# Altium project WirelessLamp.PrjPcb
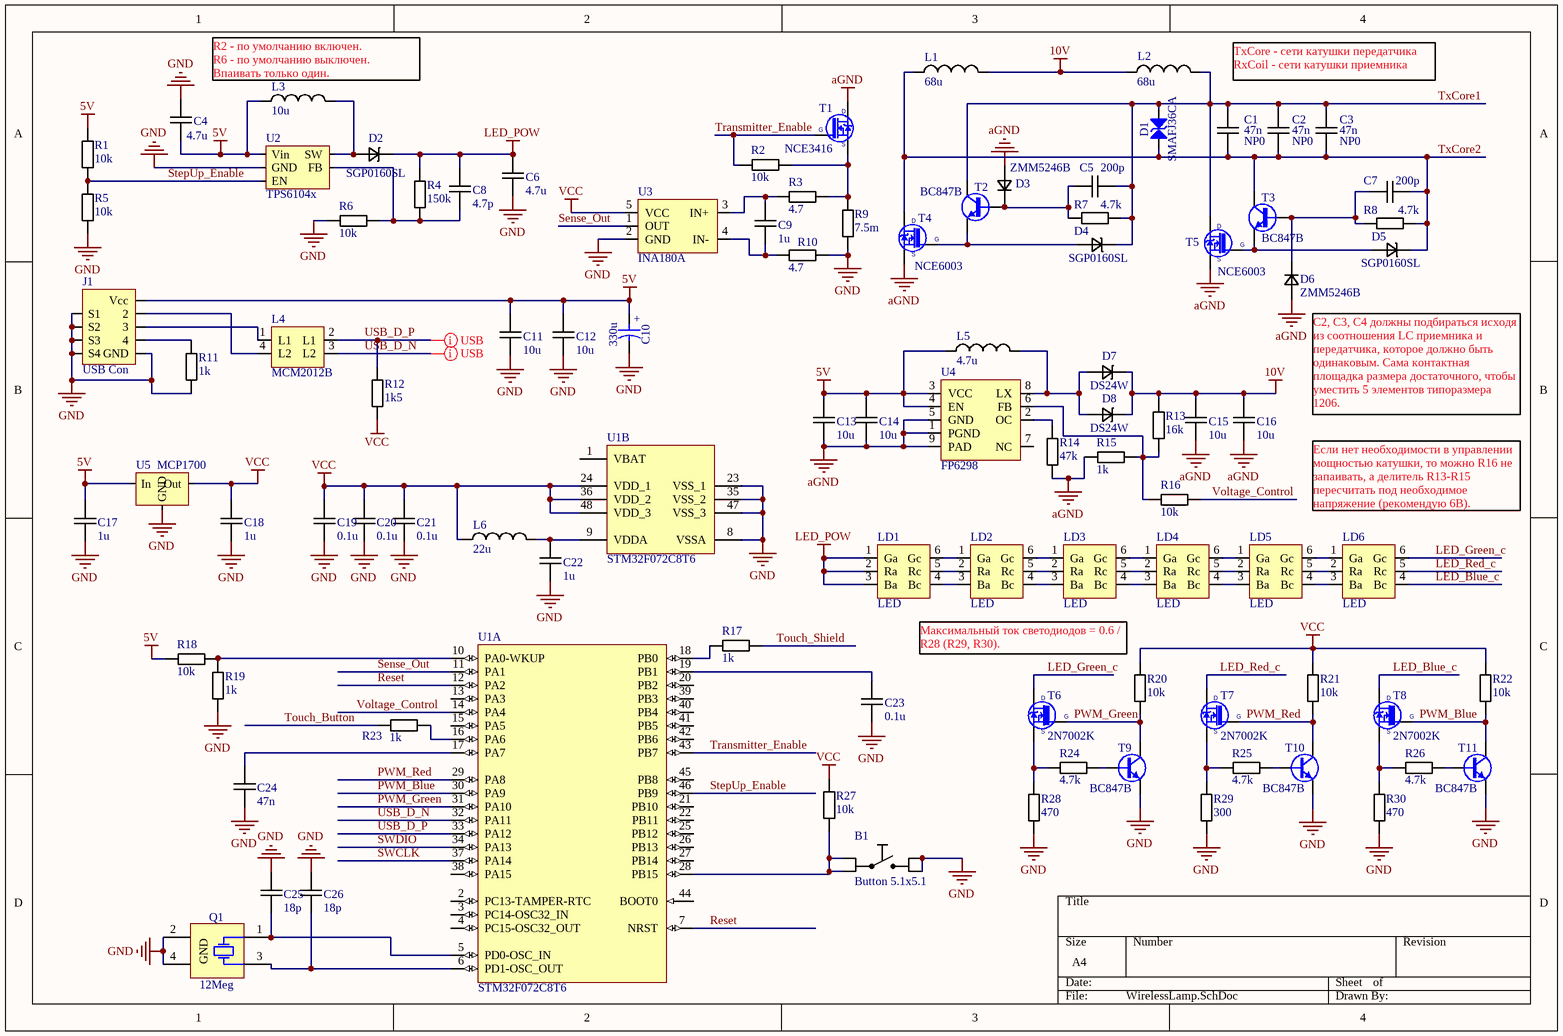
[diagram p0: WirelessLamp.SchDoc]
2 sheets, 124 parts. Net scope: global (net labels, ports and power ports of the same name join across sheets).
Board file: WirelessLamp.PcbDoc
Sheets:
  WirelessLamp.SchDoc
  WirelessLampReceiver.SchDoc

## Sheet WirelessLamp.SchDoc
size A4

### Parts
B1  Button 5.1x5.1  [TS-1187 combo]
C1  47n  Name: NP0  [CAPC3225L]
C2  47n  Name: NP0  [CAPC3225L]
C3  47n  Name: NP0  [CAPC3225L]
C4  4.7u  [CAPC3216L]
C5  200p  [CAPC2012L]
C6  4.7u  [CAPC3216L]
C7  200p  [CAPC2012L]
C8  4.7p  [CAPC1608L]
C9  1u  [CAPC1608L]
C10  330u  [CAPPR250-680X1080]
C11  10u  [CAPC3216L]
C12  10u  [CAPC3216L]
C13  10u  [CAPC3216L]
C14  10u  [CAPC3216L]
C15  10u  [CAPC3225L]
C16  10u  [CAPC3225L]
C17  1u  [CAPC2012L]
C18  1u  [CAPC2012L]
C19  0.1u  [CAPC1608L]
C20  0.1u  [CAPC1608L]
C21  0.1u  [CAPC1608L]
C22  1u  [CAPC1608L]
C23  0.1u  [CAPC2012L]
C24  47n  [CAPC3216L]
C25  18p  [CAPC1608L]
C26  18p  [CAPC1608L]
D1  SMAFJ36CA  [DIOM5226X262N]
D2  SGP0160SL  [SOD-323F]
D3  ZMM5246B  [MELF-D3512-1405]
D4  SGP0160SL  [SOD-323F]
D5  SGP0160SL  [SOD-323F]
D6  ZMM5246B  [MELF-D3512-1405]
D7  DS24W  [SOD123]
D8  DS24W  [SOD123]
J1  USB Con  [ZX62D-B-5PA8]
L1  68u  [Ind 8x8]
L2  68u  [Ind 8x8]
L3  10u  [INDC3225L]
L4  MCM2012B  [MCM2012B]
L5  4.7u  [Ind 8x8]
L6  22u  [INDC2012L]
LD1  LED  [LED5060]
LD2  LED  [LED5060]
LD3  LED  [LED5060]
LD4  LED  [LED5060]
LD5  LED  [LED5060]
LD6  LED  [LED5060]
Q1  12Meg  [XTAL_ABRACON_ABM8-166]
R1  10k  [RESC1608L]
R2  10k  [RESC1608L]
R3  4.7  [RESC1608L]
R4  150k  [RESC1608L]
R5  10k  [RESC1608L]
R6  10k  [RESC1608L]
R7  4.7k  [RESC2012L]
R8  4.7k  [RESC2012L]
R9  7.5m  [RESC2012M]
R10  4.7  [RESC1608L]
R11  1k  [RESC1608L]
R12  1k5  [RESC1608L]
R13  16k  [RESC1608L]
R14  47k  [RESC1608L]
R15  1k  [RESC1608L]
R16  10k  [RESC1608L]
R17  1k  [RESC1608L]
R18  10k  [RESC1608L]
R19  1k  [RESC1608L]
R20  10k  [RESC1608L]
R21  10k  [RESC1608L]
R22  10k  [RESC1608L]
R23  1k  [RESC1608L]
R24  4.7k  [RESC1608L]
R25  4.7k  [RESC1608L]
R26  4.7k  [RESC1608L]
R27  10k  [RESC1608L]
R28  470  [RESC2012L]
R29  300  [RESC2012L]
R30  470  [RESC2012L]
T1  NCE3416  [SOT95P237X112-3N]
T2  BC847B  [SOT95P230X110-3N]
T3  BC847B  [SOT95P230X110-3N]
T4  NCE6003  [SOT95P237X112-3N]
T5  NCE6003  [SOT95P237X112-3N]
T6  2N7002K  [SOT95P237X112-3N]
T7  2N7002K  [SOT95P237X112-3N]
T8  2N7002K  [SOT95P237X112-3N]
T9  BC847B  [SOT95P230X110-3N]
T10  BC847B  [SOT95P230X110-3N]
T11  BC847B  [SOT95P230X110-3N]
U1  STM32F072C8T6  [STM-LQFP48_N]  (parts A,B of 2)
U2  TPS6104x  [SOT23-5AL]
U3  INA180A  [SOT23-5AN]
U4  FP6298  [SOIC127P600-8DL]
U5  MCP1700  [SOT23-3L]

### Nets
5V: C4.1 C10.1 C11.2 C12.2 C13.2 C14.2 C17.2 J1.1(Vcc) L3.1 L5.1 R1.2 R18.2 U2.5(Vin) U4.3(VCC) U4.4(EN) U5.3(In)
10V: C15.2 C16.2 D7.2 D8.2 L1.2 L2.1 R13.2
aGND: C13.1 C14.1 C15.1 C16.1 D3.1 D6.1 R14.1 R15.1 T1.3(D) T4.2(S) T5.2(S) U4.1(PGND) U4.5(GND) U4.9(PAD)
GND: B1.3(FB) B1.4(FB) C4.2 C6.1 C10.2 C11.1 C12.1 C17.1 C18.1 C19.1 C20.1 C21.1 C22.1 C23.1 C24.1 C25.2 C26.2 J1.5(GND) J1.S1 J1.S2 J1.S3 J1.S4 Q1.2(GND) Q1.4(GND) R5.1 R6.1 R9.1 R10.2 R11.2 R19.1 R28.2 R29.1 R30.1 T9.2(E) T10.2(E) T11.2(E) U1.8(VSSA) U1.23(VSS_1) U1.35(VSS_2) U1.47(VSS_3) U2.2(GND) U3.2(GND) U5.1(GND)
LED_POW: C6.2 C8.2 D2.2 LD1.1(Ga) LD1.2(Ra) LD1.3(Ba) R4.2
VCC: C18.2 C19.2 C20.2 C21.2 L6.1 R12.1 R20.2 R21.2 R22.2 R27.2 U1.24(VDD_1) U1.36(VDD_2) U1.48(VDD_3) U3.5(VCC) U5.2(Out)
LED_Blue_c: LD6.4(Bc) T8.3(D)
LED_Green_c: LD6.6(Gc) T6.3(D)
LED_Red_c: LD6.5(Rc) T7.3(D)
PWM_Blue: R22.1 T8.1(G) T11.3(C) U1.30(PA9)
PWM_Green: R20.1 T6.1(G) T9.3(C) U1.31(PA10)
PWM_Red: R21.1 T7.1(G) T10.3(C) U1.29(PA8)
Reset: U1.7(NRST) U1.12(PA2)
Sense_Out: U1.11(PA1) U3.1(OUT)
StepUp_Enable: R1.1 R5.2 U1.46(PB9) U2.4(EN)
SWCLK: U1.37(PA14)
SWDIO: U1.34(PA13)
Touch_Button: R23.1
Touch_Shield: R17.2
Transmitter_Enable: R2.1 T1.1(G) U1.43(PB7)
TxCore1: C1.2 C2.2 C3.2 C5.1 D1.1(C) D4.2 L2.2 R7.1 T2.3(C) T5.3(D)
TxCore2: C1.1 C2.1 C3.1 C7.1 D1.2(A) D5.2 L1.1 R8.1 T3.3(C) T4.3(D)
USB_D_N: L4.3(L2) U1.32(PA11)
USB_D_P: L4.2(L1) R12.2 U1.33(PA12)
Voltage_Control: R16.2 U1.14(PA4)
NetB1_1: B1.1(FB) B1.2(FB) R27.1 U1.28(PB15)
NetC5_2: C5.2 D3.2 R7.2 T2.1(B)
NetC7_2: C7.2 D6.2 R8.2 T3.1(B)
NetC8_1: C8.1 R4.1 R6.2 U2.3(FB)
NetC9_1: C9.1 R10.1 U3.4(IN-)
NetC9_2: C9.2 R3.1 U3.3(IN+)
NetC22_2: C22.2 L6.2 U1.9(VDDA)
NetC23_2: C23.2 U1.19(PB1)
NetC24_2: C24.2 U1.17(PA7)
NetC25_1: C25.1 Q1.1(X) U1.5(PD0-OSC_IN)
NetC26_1: C26.1 Q1.3(X) U1.6(PD1-OSC_OUT)
NetD2_1: D2.1 L3.2 U2.1(SW)
NetD4_1: D4.1 T2.2(E) T4.1(G)
NetD5_1: D5.1 T3.2(E) T5.1(G)
NetD7_1: D7.1 D8.1 L5.2 U4.8(LX)
NetJ1_2: J1.2 L4.4(L2)
NetJ1_3: J1.3 L4.1(L1)
NetJ1_4: J1.4 R11.1
NetLD1_4: LD1.4(Bc) LD2.3(Ba)
NetLD1_5: LD1.5(Rc) LD2.2(Ra)
NetLD1_6: LD1.6(Gc) LD2.1(Ga)
NetLD2_4: LD2.4(Bc) LD3.3(Ba)
NetLD2_5: LD2.5(Rc) LD3.2(Ra)
NetLD2_6: LD2.6(Gc) LD3.1(Ga)
NetLD3_4: LD3.4(Bc) LD4.3(Ba)
NetLD3_5: LD3.5(Rc) LD4.2(Ra)
NetLD3_6: LD3.6(Gc) LD4.1(Ga)
NetLD4_4: LD4.4(Bc) LD5.3(Ba)
NetLD4_5: LD4.5(Rc) LD5.2(Ra)
NetLD4_6: LD4.6(Gc) LD5.1(Ga)
NetLD5_4: LD5.4(Bc) LD6.3(Ba)
NetLD5_5: LD5.5(Rc) LD6.2(Ra)
NetLD5_6: LD5.6(Gc) LD6.1(Ga)
NetR2_2: R2.2 R3.2 R9.2 T1.2(S)
NetR13_1: R13.1 R15.2 R16.1 U4.6(FB)
NetR14_2: R14.2 U4.2(OC)
NetR17_1: R17.1 U1.18(PB0)
NetR18_1: R18.1 R19.2 U1.10(PA0-WKUP)
NetR23_2: R23.2 U1.16(PA6)
NetR24_1: R24.1 R28.1 T6.2(S)
NetR24_2: R24.2 T9.1(B)
NetR25_1: R25.1 R29.2 T7.2(S)
NetR25_2: R25.2 T10.1(B)
NetR26_1: R26.1 R30.2 T8.2(S)
NetR26_2: R26.2 T11.1(B)

Not connected (* = marked no-connect by the designer): U1 1(VBAT) 2(PC13-TAMPER-RTC) 3(PC14-OSC32_IN) 4(PC15-OSC32_OUT) 13(PA3) 15(PA5) 20(PB2) 21(PB10) 22(PB11) 25(PB12) 26(PB13) 27(PB14) 38(PA15) 39(PB3) 40(PB4) 41(PB5) 42(PB6) 44(BOOT0) 45(PB8); U4 7(NC)

### Layout directives
differential pair: USB_D_N, USB_D_P

### Notes on the sheet
- (near L3) R2 - по умолчанию включен.
  R6 - по умолчанию выключен.
  Впаивать только один.
- TxCore - сети катушки передатчика
  RxCoil - сети катушки приемника
- (near D6) C2, C3, C4 должны подбираться исходя из соотношения LC приемника и передатчика, которое должно быть одинаковым. Сама контактная площадка размера достаточного, чтобы уместить 5 элементов типоразмера 1206.
- Если нет необходимости в управлении мощностью катушки, то можно R16 не запаивать, а делитель R13-R15 пересчитать под необходимое напряжение (рекомендую 6В).
- Максимальный ток светодиодов = 0.6 / R28 (R29, R30).
- (in symbol CAER_100UF_16V_20%_CHEMI-CON_APSA160ELL101MFA5G) +

### Library data of the parts
B1 = Button 5.1x5.1: Part: TS-1187A-B-A-B; Link: https://lcsc.com/product-detail/Tactile-Switches_XKB-Enterprise-TS-1187-B-A-A_C318884.html; LCSC Part: C318884
C1-C3 = Capacitor: Part: GRM31M5C1H473JA01L; Voltage: 50V; Case: 1206; Value: 47n; LCSC Part: C21812; Link: https://lcsc.com/product-detail/Multilayer-Ceramic-Capacitors-MLCC-SMD-SMT_muRata_GRM31M5C1H473JA01L_47nF-473-10-50V_C21812.html
C4 C8 C9 C11 C12 C17-C26 = Capacitor: Name: *
  C4: Case: 1206; Value: 4.7u
  C8: Case: 0603; Value: 4.7p
  C9 C22: Case: 0603; Value: 1u
  C11 C12: Case: 1206; Value: 10u
  C17 C18: Case: *; Value: 1u
  C19-C21: Case: 0603; Value: 0.1u
  C23: Case: 0805; Value: 0.1u
  C24: Case: 1206; Value: 47n
  C25 C26: Case: 0603; Value: 18p
C5-C7 C15 C16 = Capacitor: Voltage: 50V; Name: *
  C5 C7: Case: 0805; Value: 200p
  C6: Case: 1206; Value: 4.7u
  C15 C16: Case: 1210; Value: 10u
C10 = CAER_100UF_16V_20%_CHEMI-CON_APSA160ELL101MFA5G: Polarised capacitor; Part: 6R3AREP331M06X5E20; Voltage: 6.3V; Value: 330u; Case: LS2.5 D6.3 x H10.5; Author: CERN DEM JLC; Link: https://lcsc.com/product-detail/Solid-Polymer-Electrolytic-Capacitor_330uF-6-3V_C176297.html; LCSC Part: C176297
C13 C14 = Capacitor: Voltage: 16V; Name: *; Case: 1206; Value: 10u
D1 = SMAJ24CA: Transient Voltage Suppressor Diode (Bi-Directional); Case: DO-214AC; Author: CERN DEM JLC; Name: SMAFJ36CA; Link: https://lcsc.com/product-detail/TVS_SMAFJ36CA_C169459.html; Part: SMAFJ36CA; LCSC Part: C169459
D2 D4 D5 D7 D8 = Schotky: Value: *
  D2: Name: SGP0160SL; Case: SOD-323F; Part: SGP0160SL; Link: https://lcsc.com/product-detail/Schottky-Barrier-Diodes-SBD_SGP0160SL_C110413.html; LCSC Part: C110413
  D4: Name: SGP0160SL; Case: SOD-323F; Part: SGP0160SL; LCSC Part: C110413; Limk: https://lcsc.com/product-detail/Schottky-Barrier-Diodes-SBD_SGP0160SL_C110413.html
  D5: Name: SGP0160SL; Case: SOD-323F; Part: SGP0160SL; LCSC Part: C110413; Link: https://lcsc.com/product-detail/Schottky-Barrier-Diodes-SBD_SGP0160SL_C110413.html
  D7: Name: DS24W; Case: SOD-123F; Part: DS24W; LCSC Part: C108810; Link: https://lcsc.com/product-detail/Schottky-Barrier-Diodes-SBD_DS24W_C108810.html
  D8: Name: DS24W; Case: SOD-123F; Link: https://lcsc.com/product-detail/Schottky-Barrier-Diodes-SBD_DS24W_C108810.html; Part: DS24W; LCSC Part: C108810
D3 D6 = Diode_MELF: Name: ZMM5246B; Case: LL-34; Value: *; Part: ZMM5246B; LCSC Part: C118699; Link: https://lcsc.com/product-detail/Zener-Diodes_ZMM5246B_C118699.html
J1 = USB: Case: *; Name: *; Datasheet: https://media.digikey.com/pdf/Data%20Sheets/Hirose%20PDFs/ZX62D-AB-5P8%20RoHS.pdf
L1 L2 = Inductor: Name: SMNR8040-680MT; Case: 8040; Value: 68u; Part: SMNR8040-680MT; LCSC Part: C266439; Link: https://lcsc.com/product-detail/Inductors-SMD_ShunXiang-Connaught-Elec-SMNR8040-680MT_C266439.html
L3 = Inductor: Part: MRSC252A10-100M-N; Name: Chilisin Elec MRSC252A10-100M-N; Case: SMD,2.5x2.0x1.0mm; Value: 10u; LCSC Part: C329581; Link: https://lcsc.com/product-detail/Inductors-SMD_Chilisin-Elec-MRSC252A10-100M-N_C329581.html
L4 = MCM2012B: Part: MCM2012B900GBE; Name: MCM2012B; Link: https://lcsc.com/product-detail/EMI-RFI-Filters-LC-RC-Networks_INPAQ-MCM2012B900GBE_C315725.html; LCSC Part: C315725
L5 = Inductor: Name: SMNR8040-4R7MT; Case: 8040; Value: 4.7u; Part: SMNR8040-4R7MT; Link: https://lcsc.com/product-detail/Inductors-SMD_ShunXiang-Connaught-Elec-SMNR8040-4R7MT_C266436.html; LCSC Part: C266436
L6 = Inductor: Name: *; Case: 0805; Value: 22u
LD1-LD6 = RGB LED 5060: Part: HL-AF-5060H271BU46FU79GC-S1-THL; Name: LED; Link: https://lcsc.com/product-detail/Light-Emitting-Diodes-LED_Hongli-Zhihui-HONGLITRONIC-HL-AF-5060H271BU46FU79GC-S1-THL_C219409.html; LCSC Part: C219409
Q1 = XTAL_114.285MHZ_ABRACON_ABM8-166-114.285MHZ: Crystal 4 pins 1=XTAL Control 2=GND3=XTAL 4=GND; Part: 7U12000E12UCG; Value: 12Meg; Author: CERN DEM MR; Link: https://lcsc.com/product-detail/SMD-Crystals_SHENZHEN-CRYSTAL-TECH-7U12000E12UCG_C251605.html; LCSC Part: C251605
R1-R30 = Resistor: Model: *
  R1 R2 R5 R6 R16 R18 R20-R22 R27: Case: 0603; Value: 10k
  R3 R10: Case: 0603; Value: 4.7
  R4: Case: 0603; Value: 150k
  R7 R8: Case: 0805; Value: 4.7k
  R9: Case: 0805; Value: 7.5m; LCSC Part: C156368
  R11: Case: *; Value: 1k
  R12: Case: *; Value: 1k5
  R13: Case: 0603; Value: 16k
  R14: Case: 0603; Value: 47k
  R15 R17 R19 R23: Case: 0603; Value: 1k
  R24-R26: Case: 0603; Value: 4.7k
  R28 R30: Case: 0805; Value: 470
  R29: Case: 0805; Value: 300
T1 T4-T8 = IRLML2803PBF: N-CHANNEL MOSFET WITH ZENER DIODE; Case: SOT23-3; Author: CERN DEM JMW
  T1: Name: NCE3416; Link: https://lcsc.com/product-detail/MOSFET_Wuxi-NCE-Power-Semiconductor-NCE3416_C113491.html; Part: NCE3416; LCSC Part: C113491
  T4 T5: Name: NCE6003; Part: NCE6003; Link: https://lcsc.com/product-detail/MOSFET_Wuxi-NCE-Power-Semiconductor-NCE6003_C112351.html; LCSC Part: C112351
  T6: Name: 2N7002K; Part: 2N7002K; LCSC Part: C38161; Link: https://lcsc.com/product-detail/MOSFET_Changjiang-Electronics-Tech-CJ-2N7002K_C38161.html
  T7 T8: LCSC Part: C38161; Name: 2N7002K; Part: 2N7002K; Link: https://lcsc.com/product-detail/MOSFET_Changjiang-Electronics-Tech-CJ-2N7002K_C38161.html
T2 T3 T9-T11 = BC847B: NPN Transistor; Case: SOT23-3; Author: CERN DEM JLC; Name: BC847B
U1 = STM32F103C8T6: ARM Cortex-M3 32-bit MCU, 64 KB Flash, 20 KB Internal RAM, 37 I/Os, 48-pin LQFP, -40 to 85 degC, Tray; Case: LQFP48; Name: STM32F072C8T6; Part: STM32F072C8T6; LCSC Part: C80488
U2 = TPS6104x: Part: TPS61041DBVR; Name: TPS6104x; Link: https://lcsc.com/product-detail/DC-DC-Converters_TI_TPS61041DBVR_TPS61041DBVR_C9846.html; LCSC Part: C9846
U3 = INA180A: Part: INA180A4IDBVR; Name: INA180A; Link: https://lcsc.com/product-detail/PMIC-Current-Power-Monitors-Regulators_TI_INA180A4IDBVR_INA180A4IDBVR_C188337.html; LCSC Part: C188337
U4 = FP6298: Part: FP6298XR-G1; Name: FP6298; Link: https://lcsc.com/product-detail/DC-DC-Converters_FP6298XR-G1_C88319.html; LCSC Part: C88319
U5 = MCP1700: Part: RS3219-3.3YF3; Value: 3.3V; Name: MCP1700; Link: https://lcsc.com/product-detail/Low-Dropout-Regulators-LDO_Jiangsu-RUNIC-Tech-RS3219-3-3YF3_C255487.html; LCSC Part: C255487

## Sheet WirelessLampReceiver.SchDoc
size A4
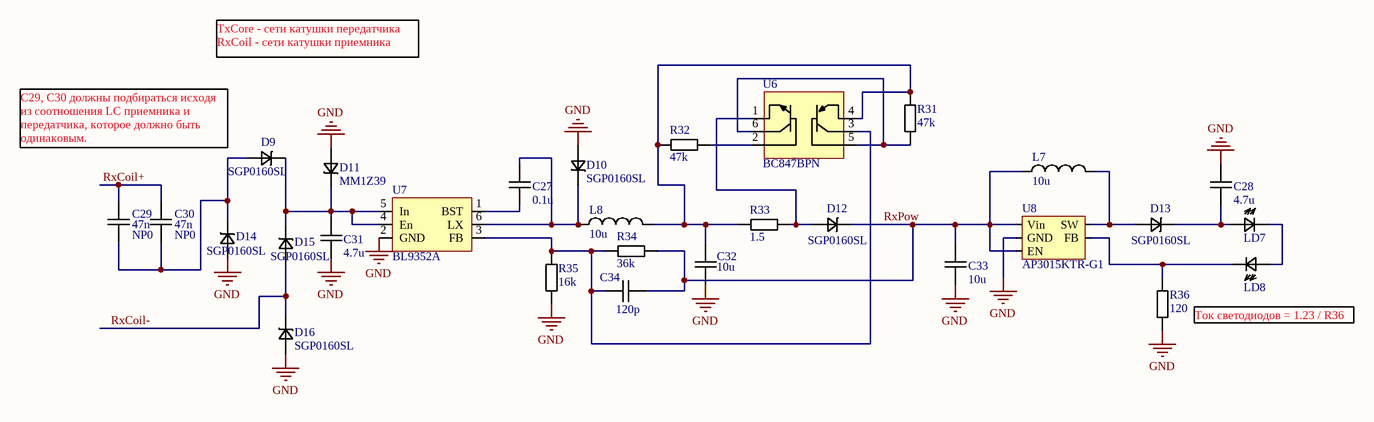
[diagram p1: WirelessLampReceiver.SchDoc]

### Parts
C27  0.1u  [CAPC1608L]
C28  4.7u  [CAPC2012L]
C29  47n  Name: NP0  [CAPC3216L]
C30  47n  Name: NP0  [CAPC3216L]
C31  4.7u  [CAPC3216L]
C32  10u  [CAPC3216L]
C33  10u  [CAPC3216L]
C34  120p  [CAPC1608L]
D9  SGP0160SL  [SOD-323F]
D10  SGP0160SL  [SOD-323F]
D11  MM1Z39  [SOD123]
D12  SGP0160SL  [SOD-323F]
D13  SGP0160SL  [SOD-323F]
D14  SGP0160SL  [SOD-323F]
D15  SGP0160SL  [SOD-323F]
D16  SGP0160SL  [SOD-323F]
L7  10u  [Ind 3x3]
L8  10u  [Ind 3x3]
LD7  LED2825  [LED2835]  (value not drawn)
LD8  LED2825  [LED2835]  (value not drawn)
R31  47k  [RESC1608L]
R32  47k  [RESC1608L]
R33  1.5  [RESC3216L]
R34  36k  [RESC1608L]
R35  16k  [RESC1608L]
R36  120  [RESC2012L]
U6  BC847BPN  [sot-363-6]
U7  BL9352A  [SOT26A-6N]
U8  AP3015KTR-G1  [SOT23-5AL]

### Nets
GND: C28.2 C31.1 C32.1 C33.1 D10.1 D11.1 D14.1 D16.1 R35.1 R36.1 U7.2(GND) U8.2(GND)
RxCoil+: C29.2 C30.1
RxCoil-: D15.1 D16.2
RxPow: C33.2 C34.2 D12.2 L7.1 R34.2 U8.4(EN) U8.5(Vin)
NetC27_1: C27.1 U7.1(BST)
NetC27_2: C27.2 D10.2 L8.1 U7.6(LX)
NetC28_1: C28.1 D13.2 LD7.2
NetC29_1: C29.1 C30.2 D9.1 D14.2
NetC31_2: C31.2 D9.2 D11.2 D15.2 U7.4(En) U7.5(In)
NetC32_2: C32.2 L8.2 R31.2 R32.1 R33.1 U6.4(ep2)
NetC34_1: C34.1 R34.1 R35.2 U6.3(cp2) U7.3(FB)
NetD12_1: D12.1 R33.2 U6.1(en1)
NetD13_1: D13.1 L7.2 U8.1(SW)
NetLD7_1: LD7.1 LD8.2
NetLD8_1: LD8.1 R36.2 U8.3(FB)
NetR31_1: R31.1 U6.5(bp2) U6.6(cn1)
NetR32_2: R32.2 U6.2(bn1)

### Notes on the sheet
- TxCore - сети катушки передатчика
  RxCoil - сети катушки приемника
- (near D9) C29, C30 должны подбираться исходя из соотношения LC приемника и передатчика, которое должно быть одинаковым.
- Ток светодиодов = 1.23 / R36

### Library data of the parts
C27 C28 C32-C34 = Capacitor: Name: *
  C27: Case: 0603; Value: 0.1u
  C28: Case: 1206; Value: 4.7u
  C32 C33: Case: 1206; Value: 10u
  C34: Case: 0603; Value: 120p
C29 C30 = Capacitor: Part: GRM31M5C1H473JA01L; Voltage: 50V; Case: 1206; Value: 47n; LCSC Part: C21812; Link: https://lcsc.com/product-detail/Multilayer-Ceramic-Capacitors-MLCC-SMD-SMT_muRata_GRM31M5C1H473JA01L_47nF-473-10-50V_C21812.html
C31 = Capacitor: Voltage: 50V; Name: *; Case: 1206; Value: 4.7u
D9 D10 D12-D16 = Schotky: Name: SGP0160SL; Case: SOD-323F; Value: *; Part: SGP0160SL; LCSC Part: C110413; Link: https://lcsc.com/product-detail/Schottky-Barrier-Diodes-SBD_SGP0160SL_C110413.html
D11 = Schotky: Value: 39V; Name: MM1Z39; Case: SOD-123; Part: MM1Z39; Link: https://lcsc.com/product-detail/Zener-Diodes_MM1Z39_C107460.html; LCSC Part: C107460
L7 L8 = Inductor: Part: PST031B-100MS; Name: Cyntec PST031B-100MS; Case: SMD,3x3x1.2mm; Value: 10u; Link: https://lcsc.com/product-detail/Inductors-SMD_Cyntec-PST031B-100MS_C218837.html; LCSC Part: C218837
R31-R36 = Resistor: Model: *
  R31 R32: Case: 0603; Value: 47k
  R33: Case: 1206; Value: 1.5
  R34: Case: 0603; Value: 36k
  R35: Case: 0603; Value: 16k
  R36: Case: 0805; Value: 120
U6 = BC847BPN: Part: BC847BPN,115; Name: BC847BPN; Case: SOT-363; LCSC Part: C8655; Link: https://lcsc.com/product-detail/Transistors-NPN-PNP_NXP_BC847BPN_BC847BPN_C8655.html
U7 = BL9352A: StepDown Regulator; Name: BL9352A; LCSC Part: C193985; Part: BL9352A; Link: https://lcsc.com/product-detail/Others_Shanghai-Belling-BL9352A_C193985.html
U8 = TPS6104x: Name: AP3015KTR-G1; Part: AP3015KTR-G1; LCSC Part: C151334; Link: https://lcsc.com/product-detail/DC-DC-Converters_DIODES_AP3015KTR-G1_AP3015KTR-G1_C151334.html

## Nets that join several sheets
GND: WirelessLamp (43 pins), WirelessLampReceiver (12 pins)